# Altium project Macropad V2.PrjPcb
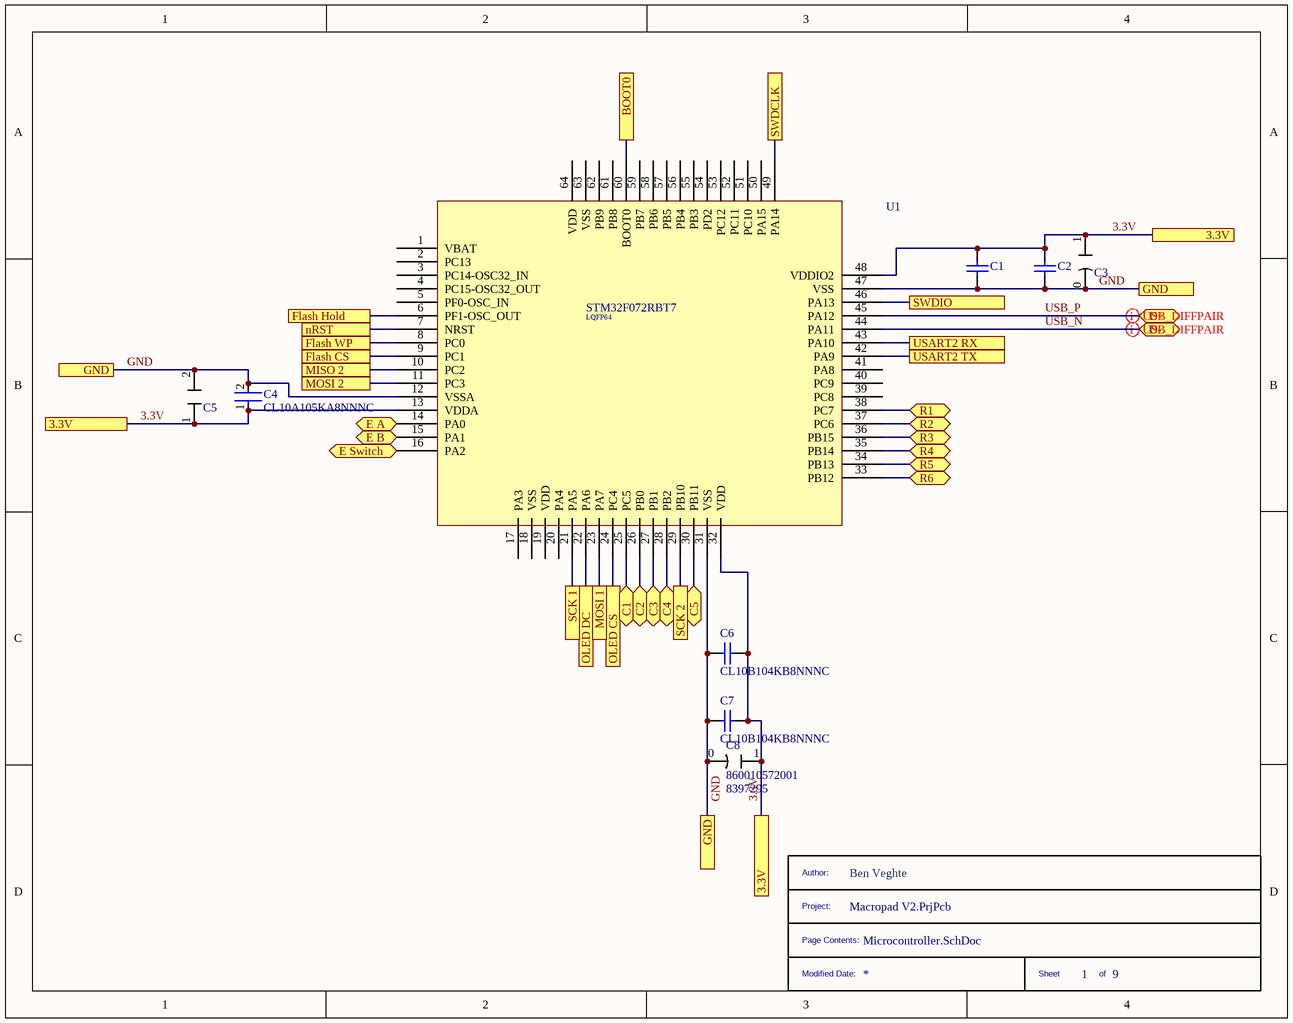
[diagram p0: Microcontroller.SchDoc]
9 sheets, 127 parts. Net scope: flat (ports and power ports of the same name join across sheets).
Board file: Macropad V2.PcbDoc
Sheets:
  Microcontroller.SchDoc
  Battery Load Share V2.SchDoc
  Reset Bootloader and Mounting.SchDoc
  Keyboard Matrix.SchDoc
  USB C Port.SchDoc
  Bluetooth.SchDoc
  Rotary Encoder.SchDoc
  OLED.SchDoc
  Flash Memory.SchDoc

## Sheet Microcontroller.SchDoc
size A; SheetNumber: 1; SheetTotal: 9

### Parts
(Parts that share a designator on the sheet are numbered #1, #2 ... from top to bottom, then left to right.)
*#1  __TITLE_BLOCK__  (value not drawn)  (graphical)
C1  CL10B104KB8NNNC  [SAMS-C0603-2_M]  (value not drawn)
C2  CL10B104KB8NNNC  [SAMS-C0603-2_M]  (value not drawn)
C3  860010572001  [860010572001]  (value not drawn)
C4  CL10A105KA8NNNC  [FP-CL10-IPC_C]
C5  CL10B103KB8NNNC  [CL10B103KB8NNNC]  (value not drawn)
C6  CL10B104KB8NNNC  [SAMS-C0603-2_M]
C7  CL10B104KB8NNNC  [SAMS-C0603-2_M]
C8  860010572001  Supplier Part Number 1: 8397295  [860010572001]
U1  STM32F072RBT7  [STM32F072RBT6]  (value not drawn)

### Ports
3.3V, BOOT0, C1 (bidir), C2 (bidir), C3 (bidir), C4 (bidir), C5 (bidir), D+ (bidir), D- (bidir), E A (bidir), E B (bidir), E Switch (bidir), Flash CS, Flash Hold, Flash WP, GND, MISO 2, MOSI 1, MOSI 2, nRST, OLED CS, OLED DC, R1 (bidir), R2 (bidir), R3 (bidir), R4 (bidir), R5 (bidir), R6 (bidir), SCK 1, SCK 2, SWDCLK, SWDIO, USART2 RX, USART2 TX

### Nets
3.3V: C1.2 C2.2 C3.1 C4.1 C5.1 C6.2 C7.2 C8.1 U1.13(VDDA) U1.32(VDD) U1.48(VDDIO2) ; port 3.3V
GND: C1.1 C2.1 C3.0 C4.2 C5.2 C6.1 C7.1 C8.0 U1.12(VSSA) U1.31(VSS) U1.47(VSS) ; port GND
USB_N: U1.44(PA11) ; port D-
USB_P: U1.45(PA12) ; port D+
NetC9_1: U1.16(PA2) ; port E Switch
NetC10_1: U1.14(PA0) ; port E A
NetC11_2: U1.15(PA1) ; port E B
NetC19_1: U1.7(NRST) ; port nRST
NetD1_1: U1.25(PC5) ; port C1
NetD2_1: U1.26(PB0) ; port C2
NetD3_1: U1.27(PB1) ; port C3
NetD4_1: U1.28(PB2) ; port C4
NetD5_1: U1.30(PB11) ; port C5
NetJ2_8: U1.24(PC4) ; port OLED CS
NetJ2_10: U1.22(PA6) ; port OLED DC
NetJ2_11: U1.21(PA5) ; port SCK 1
NetJ2_12: U1.23(PA7) ; port MOSI 1
NetJ3_2: U1.46(PA13) ; port SWDIO
NetJ3_4: U1.49(PA14) ; port SWDCLK
NetR9_1: U1.60(BOOT0) ; port BOOT0
NetS1_0: U1.38(PC7) ; port R1
NetS6_0: U1.37(PC6) ; port R2
NetS11_0: U1.36(PB15) ; port R3
NetS16_0: U1.35(PB14) ; port R4
NetS21_0: U1.34(PB13) ; port R5
NetS26_0: U1.33(PB12) ; port R6
NetU1_6: U1.6(PF1-OSC_OUT) ; port Flash Hold
NetU1_8: U1.8(PC0) ; port Flash WP
NetU1_9: U1.9(PC1) ; port Flash CS
NetU1_10: U1.10(PC2) ; port MISO 2
NetU1_11: U1.11(PC3) ; port MOSI 2
NetU1_29: U1.29(PB10) ; port SCK 2
NetU1_42: U1.42(PA9) ; port USART2 TX
NetU1_43: U1.43(PA10) ; port USART2 RX

Not connected (* = marked no-connect by the designer): U1 1(VBAT) 2(PC13) 3(PC14-OSC32_IN) 4(PC15-OSC32_OUT) 5(PF0-OSC_IN) 17(PA3) 18(VSS) 19(VDD) 20(PA4) 39(PC8) 40(PC9) 41(PA8) 50(PA15) 51(PC10) 52(PC11) 53(PC12) 54(PD2) 55(PB3) 56(PB4) 57(PB5) 58(PB6) 59(PB7) 61(PB8) 62(PB9) 63(VSS) 64(VDD)

### Layout directives
differential pair: USB_N, USB_P

### Notes on the sheet
- (in symbol __TITLE_BLOCK__) Author:; Ben Veghte; Project:; Page Contents:; Modified Date:; Sheet; of
- (in symbol STM32F072RBT7) LQFP64

### Library data of the parts
C1 C2 C6 C7 = CMP-2000-05332-1: Multi-layer Ceramic Capacitor, -55 to 125 degC, 2-Pin SMD (0603), RoHS, Tape and Reel; Manufacturer: Samsung Electro-Mechanics; Capacitance: 0.1µF; Rated Voltage: 50V; Dielectric: X7R; Tolerance (%): ±10%; Case Size/Dimension: 0603; Datasheet URL: https://datasheet.ciiva.com/29198/456651-da-01-en-vs-kondensator-0605-29198839.pdf; Manufacturer URL: http://www.samsungsem.com/global/index.jsp; Datasheet Version: Nov-10
C3 C8 = 860010572001: Aluminium Electrolytic Capacitor, Wcap-Atg8 Series, 4.7 F, 20%, 35 V, 5 Mm, Radial Leaded Rohs Compliant: Yes; Manufacturer: Wurth Electronics; Voltage Rating: 35V; Polarity: Polar; Ripple Current: 44mA; Life (Hours): 2000Hour; Capacitance: 4.7uF; Supplier 1: RSComponents; Manufacturer Part Number: 860010572001; RoHS: Yes; Category: Aluminum Electrolytic Capacitors; Stock 1: 1; Pricing 1: 50=0.09100, 250=0.06400, 500=0.05100, 1000=0.04900 (USD); Mount: Through Hole; Case/Package: Radial; Min Operating Temperature: -40°C; Max Operating Temperature: 85°C; Package Quantity: 2000; Packaging: Tape and Reel; Tolerance: 20%; Voltage Rating (DC): 35V; Diameter: 5mm; Height: 11mm; Lead Pitch: 0.079inch; Height - Seated (Max): 0.492inch; REACH SVHC: Unknown; RoHS Compliant: Yes; ComponentLink1URL: http://www.farnell.com/datasheets/1879541.pdf?src-supplier=Farnell; ComponentLink1Description: http://www.farnell.com/datasheets/1879541.pdf?src-supplier=Farnell; ComponentLink2URL: http://www.farnell.com/datasheets/1879541.pdf?src-supplier=Element14; ComponentLink2Description: http://www.farnell.com/datasheets/1879541.pdf?src-supplier=Element14; ComponentLink3URL: https://katalog.we-online.de/pbs/datasheet/860010572001.pdf?src-supplier=Digi-Key; ComponentLink3Description: https://katalog.we-online.de/pbs/datasheet/860010572001.pdf?src-supplier=Digi-Key; ComponentLink4URL: http://katalog.we-online.de/pbs/datasheet/860010572001.pdf?src-supplier=Digi-Key; ComponentLink4Description: http://katalog.we-online.de/pbs/datasheet/860010572001.pdf?src-supplier=Digi-Key
  C3: Supplier Part Number 1: 8397295
C4 = CMP-13271-004127-1: Cap Ceramic 1uF 25V X5R ±10% Pad SMD 0603 +85°C T/R; Height: 0.8mm; Capacitance: 1uF; Depth: 0.8mm; Package Quantity: 1; Mount: Surface Mount; Contact Plating: Tin; Voltage Rating: 25V; Dielectric: X5R; Packaging: Tape and Reel; Material: Ceramic; Case Code (Metric): 1608; Length: 1.6mm; Voltage: 25V; Min Operating Temperature: -55°C; Width: 0.031inch; Tolerance: 10%; Case/Package: 0603; Radiation Hardening: No; Case Code (Imperial): 0603; Thickness: 0.035inch; Lead Free: Lead Free; Max Operating Temperature: 85°C; Voltage Rating (DC): 25V
C5 = CL10B103KB8NNNC: CAP CER 10000PF 50V X7R 0603; Manufacturer: Samsung; Material: Ceramic; Capacitance: 10nF; Tolerance: 10%; Supplier 1: Arrow Electronics; Manufacturer Part Number: CL10B103KB8NNNC; RoHS: Yes; Category: Ceramic Capacitors; Stock 1: 4784000; Pricing 1: 4000=0.00480, 8000=0.00470, 12000=0.00440, 40000=0.00350 (USD); Mount: Surface Mount; Case/Package: 0603; Case Code (Metric): 1608; Case Code (Imperial): 0603; Contact Plating: Tin; Min Operating Temperature: -55°C; Max Operating Temperature: 125°C; Dielectric: X7R; Voltage Rating: 50V; Package Quantity: 1; Packaging: Tape and Reel; Voltage: 50V; Voltage Rating (DC): 50V; Series: CL; Construction: Flat; Length: 1.6mm; Width: 0.031inch; Height: 0.8mm; Depth: 0.8mm; Thickness: 0.035inch; Radiation Hardening: No; Lead Free: Lead Free; RoHS Compliant: Yes; ComponentLink1URL: https://datasheet.ciiva.com/15195/getdatasheetpartid-357415-15195721.pdf?src-supplier=Verical; ComponentLink1Description: https://datasheet.ciiva.com/15195/getdatasheetpartid-357415-15195721.pdf?src-supplier=Verical; ComponentLink2URL: https://datasheet.ciiva.com/29198/457455-da-01-en-vs-kondensator-0603-29198644.pdf?src-supplier=Conrad; ComponentLink2Description: https://datasheet.ciiva.com/29198/457455-da-01-en-vs-kondensator-0603-29198644.pdf?src-supplier=Conrad; Supplier Part Number 1: CL10B103KB8NNNC
U1 = STM32F072RBT7: MCU 32-Bit ARM Cortex-M0 RISC 64KB Flash 2V to 3.6V 64-Pin LQFP Tray; Manufacturer: STMicroelectronics; Interface: I2C,SPI,USB,HDMI,IrDA,UART,USART; Peripherals: POR,PWM,WDT,DMA; Frequency: 48MHz; Number of I/Os: 51; Memory Size: 128KB; Oscillator Type: Internal; Supplier 1: Newark; Manufacturer Part Number: STM32F072RBT7; RoHS: Yes; Category: Microcontrollers; Stock 1: 885; Pricing 1: 1=7.63000, 10=6.86000, 25=6.49000, 50=6.05000, 100=5.62000, 250=5.10000, 500=4.79000 (USD); Case/Package: LQFP; Min Operating Temperature: -40°C; Max Operating Temperature: 105°C; Memory Type: FLASH; Packaging: Tray; Core Architecture: ARM; ComponentLink1URL: http://www.st.com/content/ccc/resource/technical/document/datasheet/cd/46/43/83/22/d3/40/c8/DM00090510.pdf/files/DM00090510.pdf/jcr:content/translations/en.DM00090510.pdf?src-supplier=Digi-Key; ComponentLink1Description: http://www.st.com/content/ccc/resource/technical/document/datasheet/cd/46/43/83/22/d3/40/c8/DM00090510.pdf/files/DM00090510.pdf/jcr:content/translations/en.DM00090510.pdf?src-supplier=Digi-Key

## Sheet Battery Load Share V2.SchDoc
size A; SheetNumber: 2; SheetTotal: 9
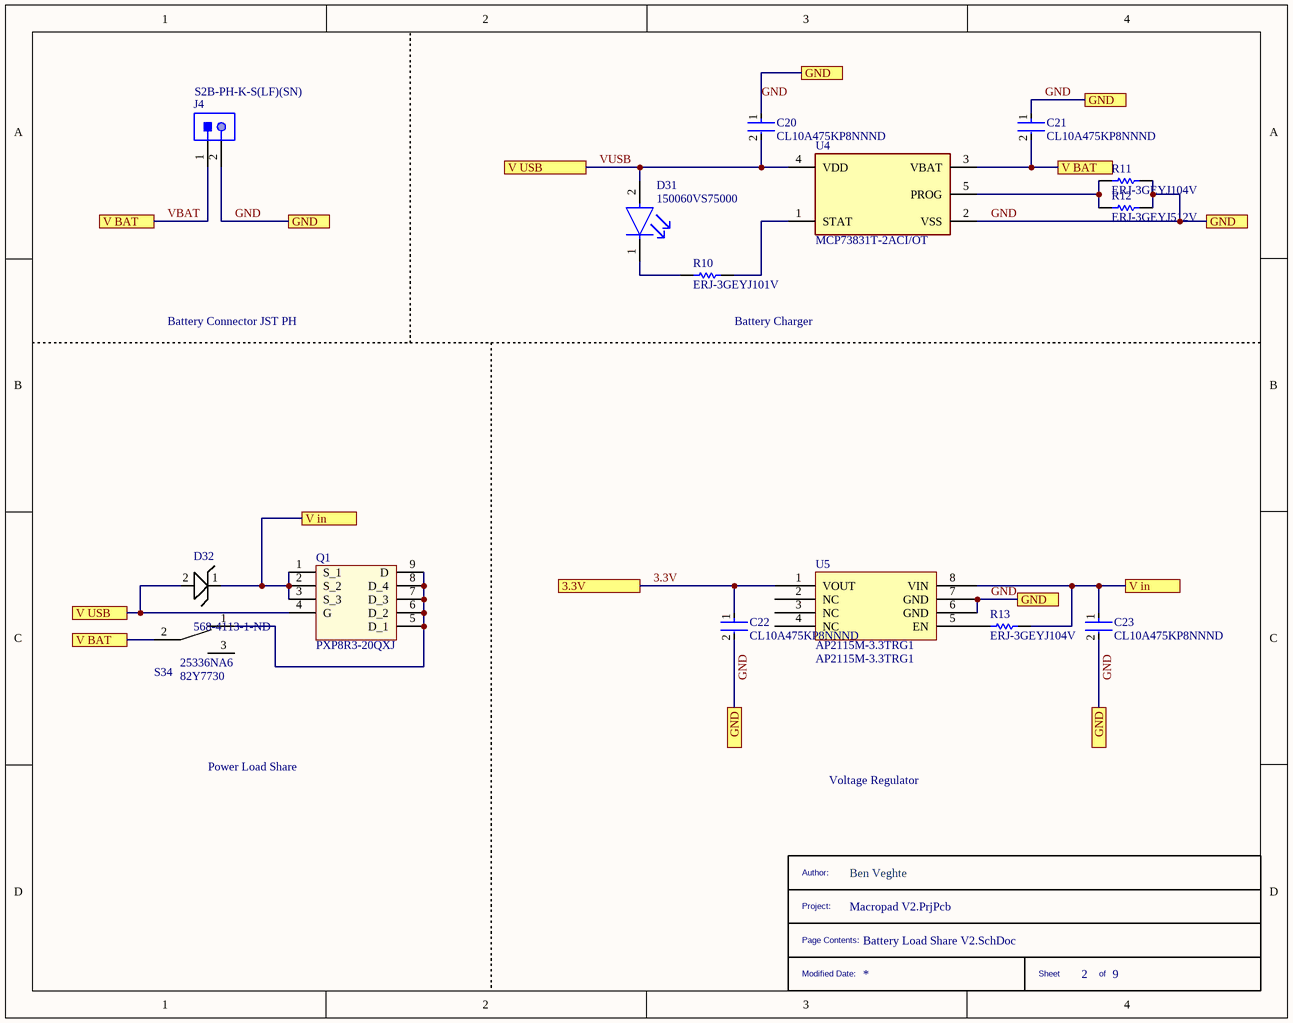
[diagram p1: Battery Load Share V2.SchDoc]

### Parts
(Parts that share a designator on the sheet are numbered #1, #2 ... from top to bottom, then left to right.)
*#2  __TITLE_BLOCK__  (value not drawn)  (graphical)
C20  CL10A475KP8NNND  [FP-CL10-IPC_C]
C21  CL10A475KP8NNND  [FP-CL10-IPC_C]
C22  CL10A475KP8NNND  [FP-CL10-IPC_C]
C23  CL10A475KP8NNND  [FP-CL10-IPC_C]
D31  150060VS75000  [FP-150060VS75000-MFG]
D32  Supplier Part Number 1: 568-4113-1-ND  [PMEG2010AEJ]  (hidden comment: PMEG2010AEJ115)
J4  S2B-PH-K-S(LF)(SN)  [JST-S2B-PH-K-S_V]
Q1  PXP8R3-20QXJ  [PXP8R3-20QXJ]
R10  ERJ-3GEYJ101V  [RESC1608X55X30LL15T15]
R11  ERJ-3GEYJ104V  [RESC1608X55X30NL15T15]
R12  ERJ-3GEYJ512V  [RESC1608X55X30LL15T15]
R13  ERJ-3GEYJ104V  [RESC1608X55X30NL15T15]
S34  25336NA6  Supplier Part Number 1: 82Y7730  [25336NA6]
U4  MCP73831T-2ACI/OT  [FP-C04-091-OT-IPC_B]
U5  AP2115M-3.3TRG1  [AP2115M-3.3TRG1]

### Ports
3.3V, GND, V BAT, V in, V USB

### Nets
3.3V: C22.1 U5.1(VOUT) ; port 3.3V
GND: C20.1 C21.1 C22.2 C23.2 J4.2 R11.2 R12.2 U4.2(VSS) U5.6(GND) U5.7(GND) ; port GND
VBAT: C21.2 J4.1 S34.2 U4.3(VBAT) ; port V BAT
VUSB: C20.2 D31.2(A) D32.2 Q1.4(G) U4.4(VDD) ; port V USB
NetC23_1: C23.1 D32.1 Q1.1(S_1) Q1.2(S_2) Q1.3(S_3) R13.2 U5.8(VIN) ; port V in
NetD31_1: D31.1(C) R10.1
NetQ1_5: Q1.5(D_1) Q1.6(D_2) Q1.7(D_3) Q1.8(D_4) Q1.9(D) S34.1
NetR10_2: R10.2 U4.1(STAT)
NetR11_1: R11.1 R12.1 U4.5(PROG)
NetR13_1: R13.1 U5.5(EN)

Not connected (* = marked no-connect by the designer): S34 3; U5 2(NC) 3(NC) 4(NC)

### Notes on the sheet
- Battery Connector JST PH
- (near R10) Battery Charger
- Power Load Share
- Voltage Regulator
- (in symbol __TITLE_BLOCK__) Author:; Ben Veghte; Project:; Page Contents:; Modified Date:; Sheet; of

### Library data of the parts
C20-C23 = CMP-13271-003065-1: Cap Ceramic 4.7uF 10V X5R ±10% Pad SMD 0603 +85°C T/R; Height: 0.8mm; Tolerance: 10%; Capacitance: 4.7uF; Voltage Rating: 10V; Voltage Rating (DC): 10V; Packaging: Tape and Reel; Dielectric: X5R; Width: 0.031inch; Max Operating Temperature: 85°C; Radiation Hardening: No; Package Quantity: 10000; Case/Package: 0603; Mount: Surface Mount; Min Operating Temperature: -55°C; Thickness: 0.035inch; Length: 1.6mm; Depth: 0.8mm
D31 = CMP-1426-00006-5: LED GREEN CLEAR 0603 SMD; Viewing Angle: 140°; Reverse Voltage (DC): 5V; Forward Voltage: 2V; Power Rating: 72mW; Lens Size: 0.7mm; Test Current: 20mA; Lens Color: Colorless; Lens Style: Rectangular; Luminous Intensity: 40mcd; Wavelength: 570nm; Length: 1.6mm; Max Operating Temperature: 85°C; Lens Transparency: Clear; Width: 0.8mm; Mount: Surface Mount; Weight: 0.000882oz; Package Quantity: 4000; Packaging: Cut Tape; RoHS Compliant: Yes; Case/Package: 0603; Series: WL-SMCW; Case Code (Metric): 1608; Illumination Color: Green; Color: Green; Case Code (Imperial): 0603; Forward Current: 20mA; Min Operating Temperature: -40°C; Height: 0.8mm; Dominant Wavelength: 570nm; Number of Pins: 2
D32 = PMEG2010AEJ115: NXP         PMEG2010AEJ,115             Schottky Rectifier, Single, 20 V, 1 A, SOD-323F, 2 Pins, 550 mV; Manufacturer: NXP Semiconductors; Max Surge Current: 10A; Forward Current: 1A; Max Reverse Current: 70uA; Forward Voltage: 550mV; Max Repetitive Reverse Voltage (Vrrm): 20V; Supplier 1: Digi-Key; Manufacturer Part Number: PMEG2010AEJ115; RoHS: Yes; Category: Schottky Diodes; Mount: Surface Mount; Number of Pins: 2; Weight: 0.01lb; Min Operating Temperature: -65°C; Max Operating Temperature: 150°C; Package Quantity: 1; Packaging: Tape and Reel; Max Reverse Leakage Current: 70uA; Average Rectified Current: 1A; Peak Non-Repetitive Surge Current: 10A; Max Forward Surge Current (Ifsm): 10A; Termination: SMD/SMT; Element Configuration: Single; Max Reverse Voltage (DC): 20V; Length: 0.25inch; Width: 0.25inch; Height: 0.25inch; Radiation Hardening: No; REACH SVHC: No SVHC; Lead Free: Lead Free; ComponentLink1URL: https://datasheet.ciiva.com/28648/666247-28648370.pdf?src-supplier=Element14; ComponentLink1Description: https://datasheet.ciiva.com/28648/666247-28648370.pdf?src-supplier=Element14; ComponentLink2URL: https://datasheet.ciiva.com/913/pmeg2010aej-913523.pdf?src-supplier=Digi-Key; ComponentLink2Description: https://datasheet.ciiva.com/913/pmeg2010aej-913523.pdf?src-supplier=Digi-Key; ComponentLink3URL: https://datasheet.ciiva.com/4714/pmeg2010aej-117858-4714480.pdf?src-supplier=Mouser; ComponentLink3Description: https://datasheet.ciiva.com/4714/pmeg2010aej-117858-4714480.pdf?src-supplier=Mouser; ComponentLink4URL: https://datasheet.ciiva.com/7965/666247-7965049.pdf?src-supplier=Element14; ComponentLink4Description: https://datasheet.ciiva.com/7965/666247-7965049.pdf?src-supplier=Element14; ComponentLink5URL: https://datasheet.ciiva.com/31423/666247-31423031.pdf?src-supplier=Farnell; ComponentLink5Description: https://datasheet.ciiva.com/31423/666247-31423031.pdf?src-supplier=Farnell; ComponentLink6URL: https://datasheet.ciiva.com/913/pmeg2010aej-913524.pdf?src-supplier=Digi-Key; ComponentLink6Description: https://datasheet.ciiva.com/913/pmeg2010aej-913524.pdf?src-supplier=Digi-Key; ComponentLink7URL: https://datasheet.ciiva.com/913/pmeg2010aej-913525.pdf?src-supplier=Digi-Key; ComponentLink7Description: https://datasheet.ciiva.com/913/pmeg2010aej-913525.pdf?src-supplier=Digi-Key
J4 = CMP-1755-00004-1: Male Header, Pitch 2 mm, 1 x 2 Position, Height 4.8 mm, Tail Length 3.4 mm, -25 to 85 degC, RoHS, Bulk; Case\Package: Radial; Tolerance: 20%; Capacitance: 10 uF; Voltage Rating (DC): 50 V; Packaging: Bulk; ComponentLink1URL: http://www.jst-mfg.com/product/pdf/eng/ePH.pdf; Radiation Hardening: No; Height: 11 mm; Package Quantity: 200; PackageDescription: Male Header, Pitch 2 mm, 1 x 2 Position, Height 4.8 mm, Tail Length 3.4 mm; PackageReference: S2B-PH-K-S; Diameter: 5 mm; Pins: 2; Mount: Through Hole; Max Operating Temperature: 85 degC; Min Operating Temperature: -40 degC; ComponentLink1Description: Datasheet; DatasheetVersion: Dec-12; Length: 11 mm; Lead Pitch: 2 mm; REACH SVHC: No SVHC; Voltage Rating: 50 V; RoHSCompliant: true
Q1 = PXP8R3-20QXJ: PXP8R3-20QX - 20 V, P-channel Trench MOSFET; Manufacturer: Nexperia; Supplier 1: Arrow Electronics; Manufacturer Part Number: PXP8R3-20QXJ; RoHS: No; Category: Uncategorized; Stock 1: 1756; Pricing 1: 1=0.70830, 10=0.62250, 25=0.61630, 50=0.61020, 100=0.46530, 250=0.46060, 500=0.34520, 1000=0.29630 (USD); Supplier Part Number 1: PXP8R3-20QXJ
R10 = CMP-2000-00702-1: Manufacturer: Panasonic; Part Number: ERJ-3GEYJ101V
R11 R13 = CMP-2000-00705-1: Manufacturer: Panasonic; Part Number: ERJ-3GEYJ104V
R12 = CMP-2000-00803-1: Manufacturer: Panasonic; Part Number: ERJ-3GEYJ512V
S34 = 25336NA6: Switch Slide ON ON SPDT Side Slide 1A 30VDC 20000Cycles PC Pins Thru-Hole; Manufacturer: APEM; Actuator Material: Nylon,Glass,Polyamide; Contact Current Rating: 4A; Voltage Rating (AC): 125V; Max Voltage Rating (AC): 250V; Voltage Rating (DC): 30V; Illumination Type: Non-Illuminated; Electrical Life: 10000Cycles; Switch Travel: 4mm; Switch Function: On-On; Actuator Type: Standard; Actuator Length: 6mm; Supplier 1: Newark; Manufacturer Part Number: 25336NA6; RoHS: Yes; Category: Slide Switches; Stock 1: 209; Pricing 1: 1=4.37000, 10=3.91000, 25=3.70000, 50=3.57000, 100=3.38000, 250=3.13000 (USD); Mount: Through Hole; Contact Plating: Silver; Contact Material: Silver; Mechanical Life: 20000Cycles; Min Operating Temperature: -40°C; Max Operating Temperature: 85°C; Package Quantity: 100; Throw Configuration: SPDT; Max Current Rating: 1A; Packaging: Bulk; Current Rating: 1A; Max Voltage Rating (DC): 30V; Termination: PC Pins; Orientation: Right Angle; Length: 14.1mm; Depth: 13.5mm; REACH SVHC: No SVHC; RoHS Compliant: Yes; ComponentLink1URL: https://datasheet.ciiva.com/22638/1686052-22638216.pdf?src-supplier=Element14; ComponentLink1Description: https://datasheet.ciiva.com/22638/1686052-22638216.pdf?src-supplier=Element14
U4 = CMP-0133-00143-2: IC CONTROLLR LI-ION 4.2V SOT23-5; Max Power Dissipation: 1.54W; Output Current: 500mA; Max Output Voltage: 4.5V; Number of Outputs: 1; Min Output Voltage: 4.168V; Min Supply Voltage: 3.75V; Max Input Voltage: 6V; Voltage Rating: 4.534V; Drain to Source Resistance: 350mR; Max Operating Temperature: 85°C; Length: 0.122inch; Number of Pins: 5; REACH SVHC: No SVHC; Radiation Hardening: No; Min Operating Temperature: -40°C; Weight: 0.00709oz; Contact Plating: Tin; Termination: SMD/SMT; Case/Package: SOT-23; Mount: Surface Mount; Width: 0.071inch; Packaging: Tape and Reel; Number of Cells: 1; Max Charge Current: 500mA; Height: 0.051inch; Number of Channels: 1; Output Voltage: 4.2V; Max Supply Voltage: 6V; Lead Free: Lead Free
U5 = AP2115M-3.3TRG1: LDO Regulator Pos 3.3V 1A 8-Pin SOIC T/R; Manufacturer: Diodes; Dropout Voltage: 450mV; Number of Regulators: 1; Supplier 1: Arrow Electronics; Manufacturer Part Number: AP2115M-3.3TRG1; RoHS: Yes; Category: Voltage Regulators - Linear; Stock 1: 3960; Pricing 1: 1=0.39860, 10=0.32620, 25=0.30340, 100=0.20830, 250=0.19280, 500=0.15840, 1000=0.11820, 3000=0.11710 (USD); Mount: Surface Mount; Case/Package: SOIC; Min Operating Temperature: -40°C; Max Operating Temperature: 85°C; Packaging: Tape and Reel; Output Voltage: 3.3V; Output Current: 1A; RoHS Compliant: Yes; ComponentLink1URL: http://www.mouser.com/ds/2/115/AP2115-464923.pdf?src-supplier=Mouser; ComponentLink1Description: http://www.mouser.com/ds/2/115/AP2115-464923.pdf?src-supplier=Mouser; ComponentLink2URL: https://www.diodes.com/assets/Datasheets/AP2115.pdf?src-supplier=Digi-Key; ComponentLink2Description: https://www.diodes.com/assets/Datasheets/AP2115.pdf?src-supplier=Digi-Key; Supplier Part Number 1: AP2115M-3.3TRG1

## Sheet Reset Bootloader and Mounting.SchDoc
size A; SheetNumber: 3; SheetTotal: 9
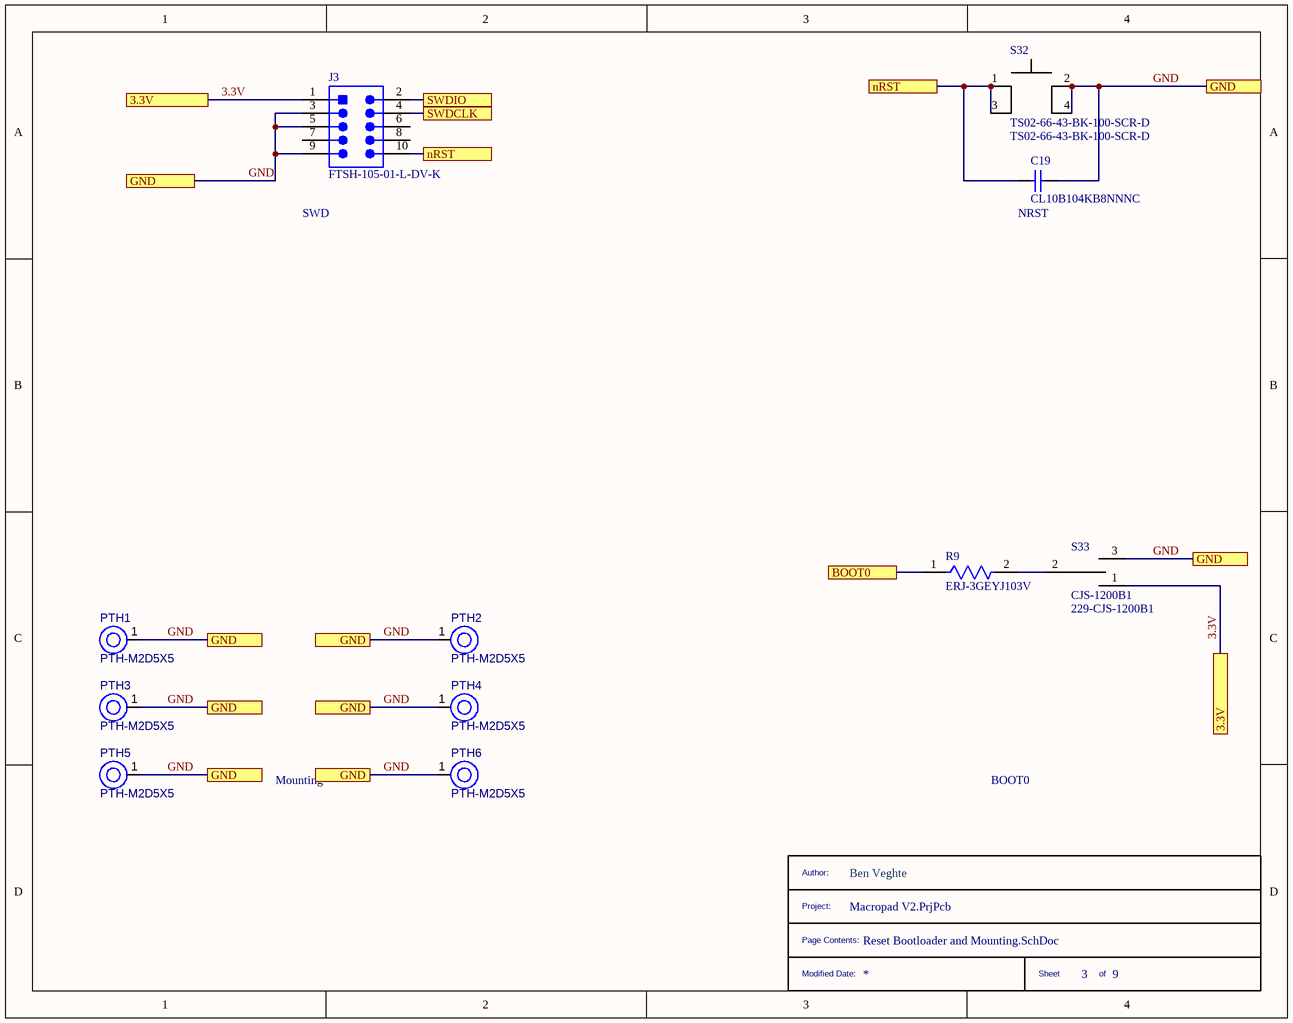
[diagram p2: Reset Bootloader and Mounting.SchDoc]

### Parts
(Parts that share a designator on the sheet are numbered #1, #2 ... from top to bottom, then left to right.)
*#3  __TITLE_BLOCK__  (value not drawn)  (graphical)
C19  CL10B104KB8NNNC  [SAMS-C0603-2_M]
J3  FTSH-105-01-L-DV-K  [SMTC-FTSH-105-01-L-DV-K_V]
PTH1  PTH-M2D5X5  [PTH-M2D5X5]
PTH2  PTH-M2D5X5  [PTH-M2D5X5]
PTH3  PTH-M2D5X5  [PTH-M2D5X5]
PTH4  PTH-M2D5X5  [PTH-M2D5X5]
PTH5  PTH-M2D5X5  [PTH-M2D5X5]
PTH6  PTH-M2D5X5  [PTH-M2D5X5]
R9  ERJ-3GEYJ103V  [FP-ERJ3G-IPC_C]
S32  TS02-66-43-BK-100-SCR-D  [TS02-66-43-BK-100-SCR-D]
S33  CJS-1200B1  Supplier Part Number 2: 229-CJS-1200B1  [CJS-1200B1]

### Ports
3.3V, BOOT0, GND, nRST, SWDCLK, SWDIO

### Nets
3.3V: J3.1 S33.1 ; port 3.3V
GND: C19.2 J3.3 J3.5 J3.9 PTH1.1(H1) PTH2.1(H1) PTH3.1(H1) PTH4.1(H1) PTH5.1(H1) PTH6.1(H1) S32.2 S32.4 S33.3 ; port GND
NetC19_1: C19.1 J3.10 S32.1 S32.3 ; port nRST
NetJ3_2: J3.2 ; port SWDIO
NetJ3_4: J3.4 ; port SWDCLK
NetR9_1: R9.1 ; port BOOT0
NetR9_2: R9.2 S33.2

Not connected (* = marked no-connect by the designer): J3 6 7 8

### Notes on the sheet
- SWD
- (near C19) NRST
- Mounting
- BOOT0
- (in symbol __TITLE_BLOCK__) Author:; Ben Veghte; Project:; Page Contents:; Modified Date:; Sheet; of

### Library data of the parts
C19 = CMP-2000-05332-1: as C1 on sheet Microcontroller; Case Size/Dimension: 0603; Datasheet URL: https://datasheet.ciiva.com/29198/456651-da-01-en-vs-kondensator-0605-29198839.pdf; Manufacturer URL: http://www.samsungsem.com/global/index.jsp; Datasheet Version: Nov-10
J3 = CMP-2000-05353-1: Male Header, Pitch 1.27 mm, 2 x 5 Position, Height 6.25 mm; Manufacturer: Samtec; Pitch: 0.050"(1.27mm); Other Names: Q3937619; Number of Positions: 10; Mating Products: SFMC-105-L2-S-D-TR-ND / -CONN.05"SURFACE10POSSMT / FLE-105-01-G-DV-TR-ND / -CONNSKT1.27MM10POSDUALSMD / FLE-105-01-G-DV-A-P-ND / -CONNSKT1.27MM10POSDUALSMD / FLE-105-01-G-DV-A-ND / -CONNSKT1.27MM10POSDUALSMD / CLP-105-02-G-D-P-TR-ND / -CONNRCPT10POSDUAL.05"SMD / SAM1155-05-ND / -CONNRCPT10POSDUAL.05"SMD / SAM1154-05-ND / -CONNRCPT10POSDUAL.05"SMD / SAM1153-05-ND / -CONNRCPT10POSDUAL.05"SMD / SAM1226-05-ND / -CONNRCPT.05"10POSDUALSMD; Number of Positions Loaded: All; Connector Type: Header,Unshrouded; Product Training Modules: Board-to-BoardConnectors; Datasheet Version: Rev. ET, 10/1995; Number of Rows: 2; Standard Package: 1; Package Description: Male Header, Pitch 1.27 mm, 2 x 5 Position, Height 5.97 mm, Tail Length 4.32 mm; Contact Finish Thickness: 10µin(0.25µm); Series: FTSH; Termination: Solder; Contact Type: MalePin; Color: Black; Package Reference: FTSH-105-01-L-DV-K; Family: RectangularConnectors-Headers,MalePins; Package URL: http://suddendocs.samtec.com/prints/ftsh-1xx-xx-xxx-dv-xxx-footprint.pdf; Packaging: Tube; Mounting Type: SurfaceMount; Category: Connectors,Interconnects; Datasheet URL: http://suddendocs.samtec.com/prints/ftsh-1xx-xx-xxx-dv-xxx-mkt.pdf; Row Spacing: 0.050"(1.27mm); Manufacturer URL: http://www.samtec.com/; Contact Mating Length: 0.120"(3.05mm); Contact Finish: Gold
PTH1-PTH6 = CMP-00028-00004-2: M2 PTH (2.5mm), 5mm pad; Pins: 1
R9 = CMP-2000-00704-2: RES SMD 10K OHM 5% 1/10W 0603; Temperature Coefficient: 200ppm/°C; Max Power Dissipation: 100mW; Resistance: 10kR; Voltage Rating (DC): 50V; Voltage Rating: 75V; Resistor Type: Thick Film; Tolerance: 5%; Military Standard: Not; Package Quantity: 1; Max Operating Temperature: 155°C; Mount: Surface Mount; Technology: THICK FILM; Case/Package: 0603; Construction: Rectangular; Depth: 0.8mm; Case Code (Imperial): 0603; Weight: 7.1E-05oz; Features: Automotive AEC-Q200; Packaging: Tape and Reel; Width: 0.8mm; Length: 1.6mm; Termination: SMD/SMT; Power Rating: 100mW; Lead Free: Lead Free; Number of Terminations: 2; Height: 0.45mm; RoHS Compliant: Yes; Min Operating Temperature: -55°C; Contact Plating: Tin; REACH SVHC: No SVHC; Resistance Tolerance: 5%; Series: ERJ; Working Voltage: 75V; Case Code (Metric): 1608
S32 = TS02-66-43-BK-100-SCR-D: Switch Tactile OFF (ON) SPST Round Button PC Pins 0.05A 12VDC 100000Cycles 1N Thru-Hole Bag; Manufacturer: CUI Devices; Supplier 1: Arrow Electronics; Manufacturer Part Number: TS02-66-43-BK-100-SCR-D; RoHS: No; Stock 1: 6000; Pricing 1: 1=0.09100, 25=0.08560, 100=0.07670, 250=0.07150, 500=0.06460, 1000=0.05270, 2000=0.05130, 5000=0.04740 (USD); Supplier Part Number 1: TS02-66-43-BK-100-SCR-D
S33 = CJS-1200B1: Switch Slide N.O./N.C. SPDT Raised Slide 0.1A 24VDC Gull Wing SMD Bulk; Manufacturer: CUI; Manufacturer Part Number: DS01-254-L-01BE; Max Voltage Rating (DC): 24V; Supplier 1: Mouser; RoHS: Yes; Supplier 2: Mouser; Category: DIP Switches; Stock 2: 600; Pricing 2: 1=0.73000, 10=0.64700, 20=0.63300, 50=0.63300, 100=0.63200, 200=0.56100, 500=0.53500, 1000=0.51700, 2000=0.49800, 10000=0.49800 (USD); Mount: Surface Mount; Case/Package: SMD/SMT; Contact Plating: Gold; Contact Material: Copper Alloy; Min Operating Temperature: -40°C; Max Operating Temperature: 85°C; Throw Configuration: SPDT; Packaging: Bulk; Termination: Gull Wing; Radiation Hardening: No; Lead Free: Lead Free; RoHS Compliant: Yes; ComponentLink1URL: https://www.nidec-copal-electronics.com/e/catalog/switch/cjs.pdf?src-supplier=Digi-Key; ComponentLink1Description: https://www.nidec-copal-electronics.com/e/catalog/switch/cjs.pdf?src-supplier=Digi-Key; ComponentLink2URL: http://www.nidec-copal-electronics.com/e/product/files/file/b1d651d581b7f6382a1a6c96f0c036e447720c59.pdf?src-supplier=Avnet; ComponentLink2Description: http://www.nidec-copal-electronics.com/e/product/files/file/b1d651d581b7f6382a1a6c96f0c036e447720c59.pdf?src-supplier=Avnet

## Sheet Keyboard Matrix.SchDoc
size B; SheetNumber: 4; SheetTotal: 9
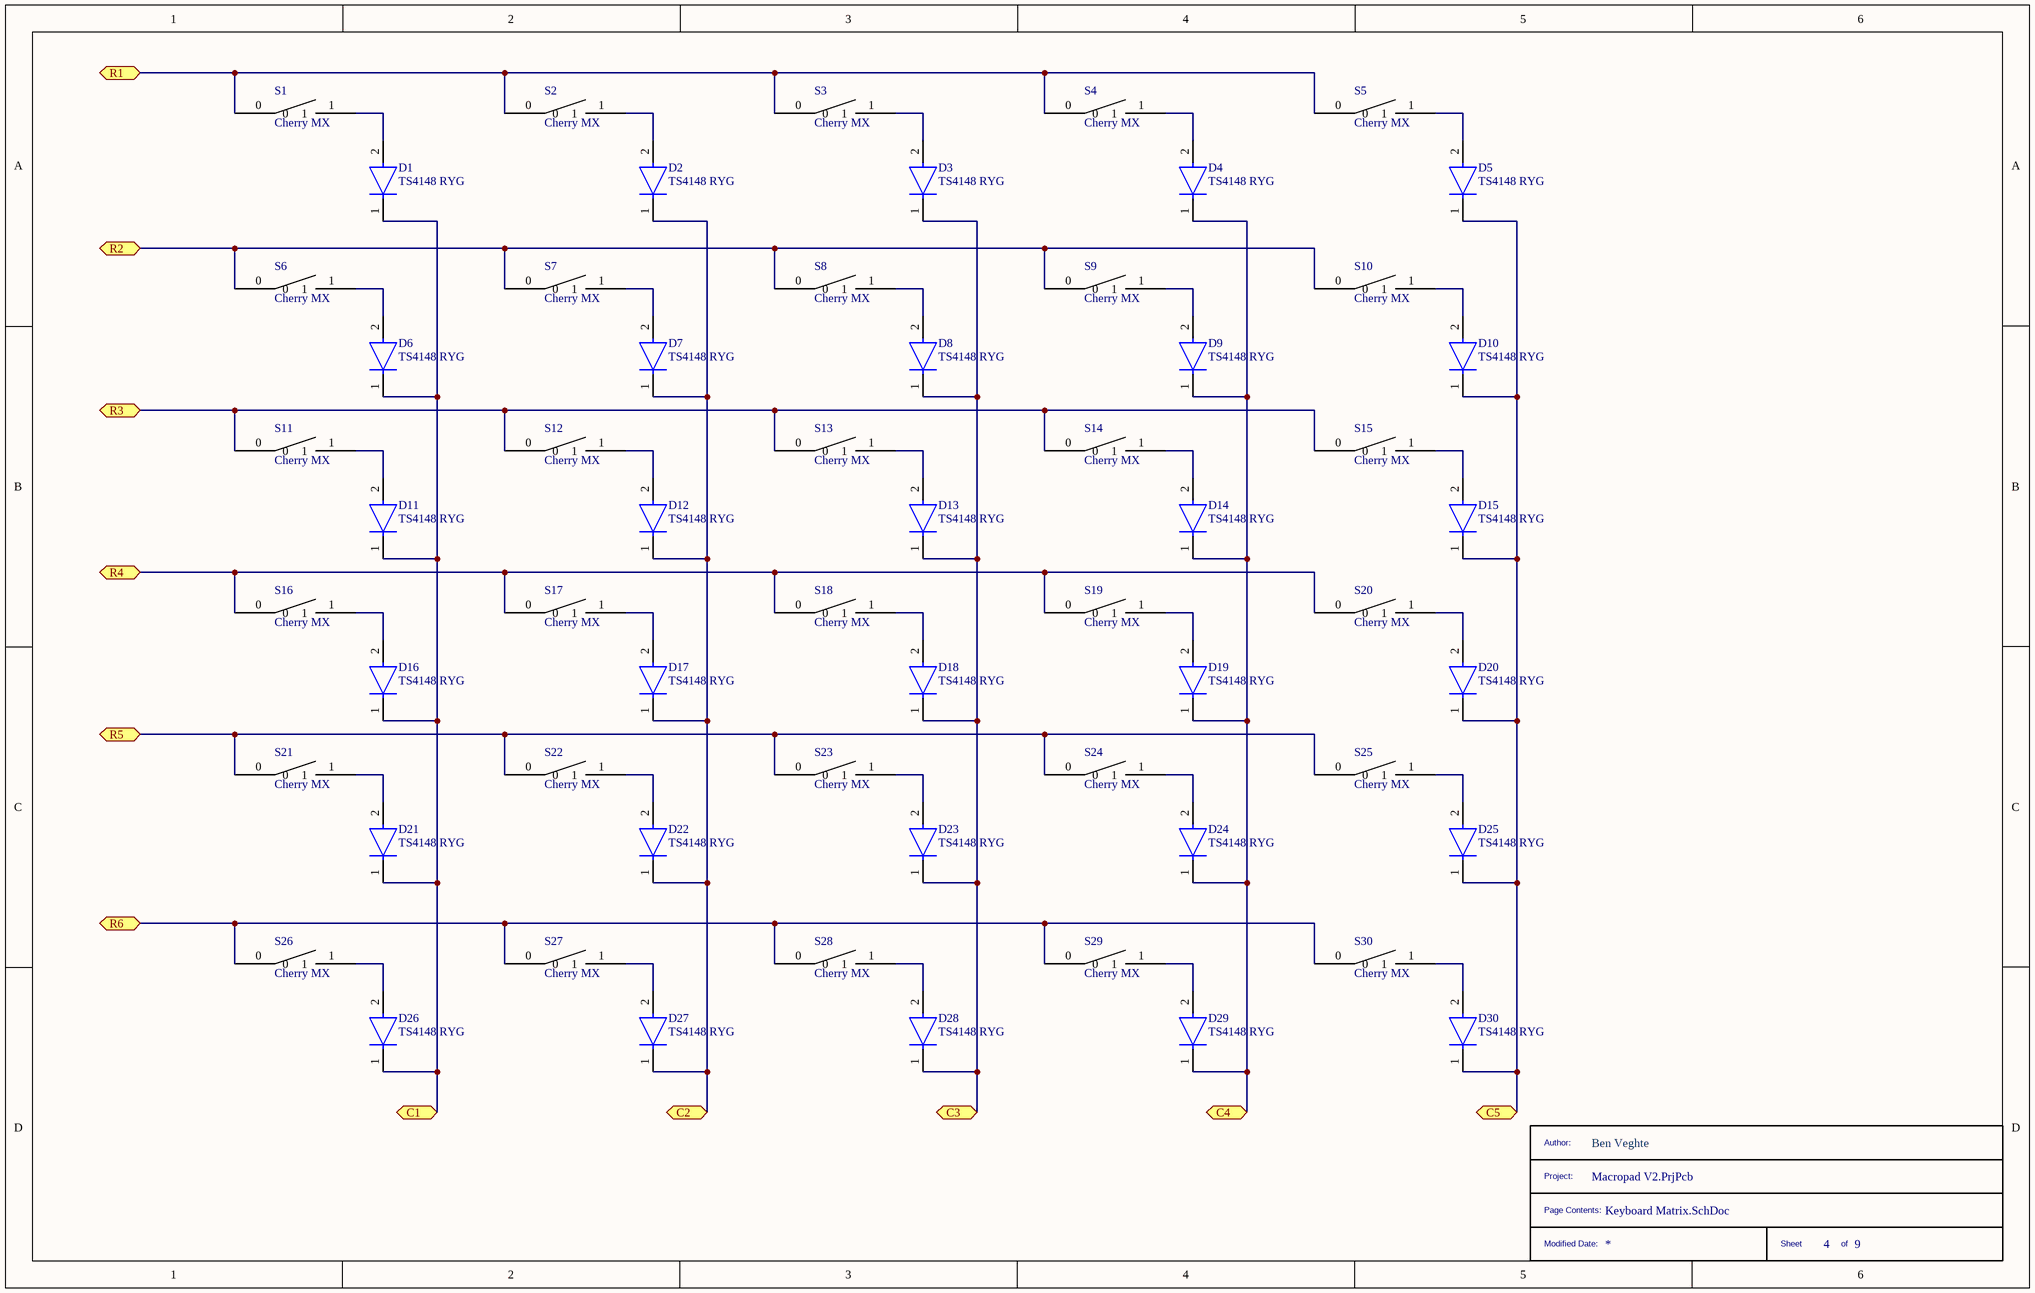
[diagram p3: Keyboard Matrix.SchDoc]

### Parts
(Parts that share a designator on the sheet are numbered #1, #2 ... from top to bottom, then left to right.)
*#4  __TITLE_BLOCK__  (value not drawn)  (graphical)
D1  TS4148 RYG  [FP-TS4148_RYG-MFG]
D2  TS4148 RYG  [FP-TS4148_RYG-MFG]
D3  TS4148 RYG  [FP-TS4148_RYG-MFG]
D4  TS4148 RYG  [FP-TS4148_RYG-MFG]
D5  TS4148 RYG  [FP-TS4148_RYG-MFG]
D6  TS4148 RYG  [FP-TS4148_RYG-MFG]
D7  TS4148 RYG  [FP-TS4148_RYG-MFG]
D8  TS4148 RYG  [FP-TS4148_RYG-MFG]
D9  TS4148 RYG  [FP-TS4148_RYG-MFG]
D10  TS4148 RYG  [FP-TS4148_RYG-MFG]
D11  TS4148 RYG  [FP-TS4148_RYG-MFG]
D12  TS4148 RYG  [FP-TS4148_RYG-MFG]
D13  TS4148 RYG  [FP-TS4148_RYG-MFG]
D14  TS4148 RYG  [FP-TS4148_RYG-MFG]
D15  TS4148 RYG  [FP-TS4148_RYG-MFG]
D16  TS4148 RYG  [FP-TS4148_RYG-MFG]
D17  TS4148 RYG  [FP-TS4148_RYG-MFG]
D18  TS4148 RYG  [FP-TS4148_RYG-MFG]
D19  TS4148 RYG  [FP-TS4148_RYG-MFG]
D20  TS4148 RYG  [FP-TS4148_RYG-MFG]
D21  TS4148 RYG  [FP-TS4148_RYG-MFG]
D22  TS4148 RYG  [FP-TS4148_RYG-MFG]
D23  TS4148 RYG  [FP-TS4148_RYG-MFG]
D24  TS4148 RYG  [FP-TS4148_RYG-MFG]
D25  TS4148 RYG  [FP-TS4148_RYG-MFG]
D26  TS4148 RYG  [FP-TS4148_RYG-MFG]
D27  TS4148 RYG  [FP-TS4148_RYG-MFG]
D28  TS4148 RYG  [FP-TS4148_RYG-MFG]
D29  TS4148 RYG  [FP-TS4148_RYG-MFG]
D30  TS4148 RYG  [FP-TS4148_RYG-MFG]
S1  Cherry MX  [Cherry MX]
S2  Cherry MX  [Cherry MX]
S3  Cherry MX  [Cherry MX]
S4  Cherry MX  [Cherry MX]
S5  Cherry MX  [Cherry MX]
S6  Cherry MX  [Cherry MX]
S7  Cherry MX  [Cherry MX]
S8  Cherry MX  [Cherry MX]
S9  Cherry MX  [Cherry MX]
S10  Cherry MX  [Cherry MX]
S11  Cherry MX  [Cherry MX]
S12  Cherry MX  [Cherry MX]
S13  Cherry MX  [Cherry MX]
S14  Cherry MX  [Cherry MX]
S15  Cherry MX  [Cherry MX]
S16  Cherry MX  [Cherry MX]
S17  Cherry MX  [Cherry MX]
S18  Cherry MX  [Cherry MX]
S19  Cherry MX  [Cherry MX]
S20  Cherry MX  [Cherry MX]
S21  Cherry MX  [Cherry MX]
S22  Cherry MX  [Cherry MX]
S23  Cherry MX  [Cherry MX]
S24  Cherry MX  [Cherry MX]
S25  Cherry MX  [Cherry MX]
S26  Cherry MX  [Cherry MX]
S27  Cherry MX  [Cherry MX]
S28  Cherry MX  [Cherry MX]
S29  Cherry MX  [Cherry MX]
S30  Cherry MX  [Cherry MX]

### Ports
C1 (bidir), C2 (bidir), C3 (bidir), C4 (bidir), C5 (bidir), R1 (bidir), R2 (bidir), R3 (bidir), R4 (bidir), R5 (bidir), R6 (bidir)

### Nets
NetD1_1: D1.1(C) D6.1(C) D11.1(C) D16.1(C) D21.1(C) D26.1(C) ; port C1
NetD1_2: D1.2(A) S1.1
NetD2_1: D2.1(C) D7.1(C) D12.1(C) D17.1(C) D22.1(C) D27.1(C) ; port C2
NetD2_2: D2.2(A) S2.1
NetD3_1: D3.1(C) D8.1(C) D13.1(C) D18.1(C) D23.1(C) D28.1(C) ; port C3
NetD3_2: D3.2(A) S3.1
NetD4_1: D4.1(C) D9.1(C) D14.1(C) D19.1(C) D24.1(C) D29.1(C) ; port C4
NetD4_2: D4.2(A) S4.1
NetD5_1: D5.1(C) D10.1(C) D15.1(C) D20.1(C) D25.1(C) D30.1(C) ; port C5
NetD5_2: D5.2(A) S5.1
NetD6_2: D6.2(A) S6.1
NetD7_2: D7.2(A) S7.1
NetD8_2: D8.2(A) S8.1
NetD9_2: D9.2(A) S9.1
NetD10_2: D10.2(A) S10.1
NetD11_2: D11.2(A) S11.1
NetD12_2: D12.2(A) S12.1
NetD13_2: D13.2(A) S13.1
NetD14_2: D14.2(A) S14.1
NetD15_2: D15.2(A) S15.1
NetD16_2: D16.2(A) S16.1
NetD17_2: D17.2(A) S17.1
NetD18_2: D18.2(A) S18.1
NetD19_2: D19.2(A) S19.1
NetD20_2: D20.2(A) S20.1
NetD21_2: D21.2(A) S21.1
NetD22_2: D22.2(A) S22.1
NetD23_2: D23.2(A) S23.1
NetD24_2: D24.2(A) S24.1
NetD25_2: D25.2(A) S25.1
NetD26_2: D26.2(A) S26.1
NetD27_2: D27.2(A) S27.1
NetD28_2: D28.2(A) S28.1
NetD29_2: D29.2(A) S29.1
NetD30_2: D30.2(A) S30.1
NetS1_0: S1.0 S2.0 S3.0 S4.0 S5.0 ; port R1
NetS6_0: S6.0 S7.0 S8.0 S9.0 S10.0 ; port R2
NetS11_0: S11.0 S12.0 S13.0 S14.0 S15.0 ; port R3
NetS16_0: S16.0 S17.0 S18.0 S19.0 S20.0 ; port R4
NetS21_0: S21.0 S22.0 S23.0 S24.0 S25.0 ; port R5
NetS26_0: S26.0 S27.0 S28.0 S29.0 S30.0 ; port R6

### Notes on the sheet
- (in symbol __TITLE_BLOCK__) Author:; Ben Veghte; Project:; Page Contents:; Modified Date:; Sheet; of

### Library data of the parts
D1-D30 = CMP-15605-000006-1: Rectifier Diode Switching 75V 0.15A 4ns 2-Pin Case 0805(2012Metric) T/R; Peak Non-Repetitive Surge Current: 2A; Element Configuration: Single; Forward Voltage: 1V; Max Operating Temperature: 175°C; Packaging: Tape and Reel; Radiation Hardening: No; Min Operating Temperature: -65°C; Reverse Recovery Time: 4ns; Mount: Surface Mount; RoHS Compliant: Yes; Max Forward Surge Current (Ifsm): 2A; Case/Package: SMD/SMT; Number of Pins: 2; Max Repetitive Reverse Voltage (Vrrm): 75V
S1-S30 = Cherry MX: Cherry MX Brown With Fixation Pins

## Sheet USB C Port.SchDoc
size A; SheetNumber: 5; SheetTotal: 9
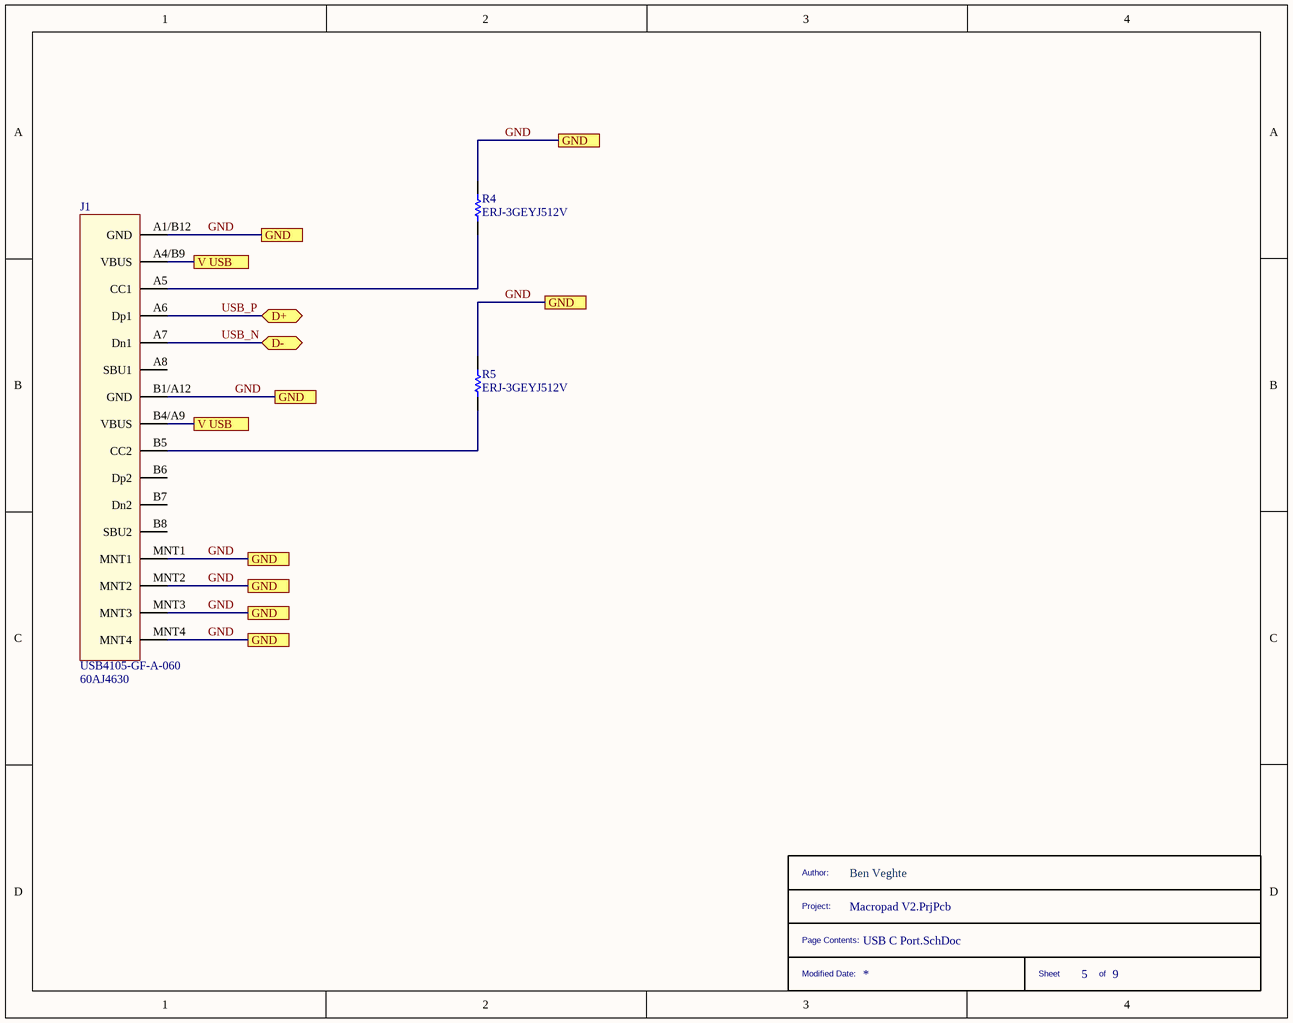
[diagram p4: USB C Port.SchDoc]

### Parts
(Parts that share a designator on the sheet are numbered #1, #2 ... from top to bottom, then left to right.)
*#5  __TITLE_BLOCK__  (value not drawn)  (graphical)
J1  USB4105-GF-A-060  Supplier Part Number 1: 60AJ4630  [USB4105-GF-A-120]
R4  ERJ-3GEYJ512V  [RESC1608X55X30LL15T15]
R5  ERJ-3GEYJ512V  [RESC1608X55X30LL15T15]

### Ports
D+ (bidir), D- (bidir), GND, V USB

### Nets
GND: J1.A1/B12(GND) J1.B1/A12(GND) J1.MNT1 J1.MNT2 J1.MNT3 J1.MNT4 R4.2 R5.2 ; port GND
USB_N: J1.A7(Dn1) ; port D-
USB_P: J1.A6(Dp1) ; port D+
VUSB: J1.A4/B9(VBUS) J1.B4/A9(VBUS) ; port V USB
NetJ1_A5: J1.A5(CC1) R4.1
NetJ1_B5: J1.B5(CC2) R5.1

Not connected (* = marked no-connect by the designer): J1 A8(SBU1) B6(Dp2) B7(Dn2) B8(SBU2)

### Notes on the sheet
- (in symbol __TITLE_BLOCK__) Author:; Ben Veghte; Project:; Page Contents:; Modified Date:; Sheet; of

### Library data of the parts
J1 = USB4105-GF-A-060: USB CONN, 2.0 TYPE C, RCPT, 16POS, SMT; USB Connector Type: USB Type C; USB Standard: USB 2.0; Gender: Receptacle;...; Manufacturer: Global Connector Technology; Supplier 1: Newark; Manufacturer Part Number: USB4105-GF-A-060; RoHS: Yes; Category: Connectors; Stock 1: 1600; Pricing 1: 1=0.93700, 100=0.74000, 250=0.67600, 500=0.61600, 800=0.61600, 1000=0.57400 (USD)
R4 R5 = CMP-2000-00803-1: Manufacturer: Panasonic; Part Number: ERJ-3GEYJ512V

## Sheet Bluetooth.SchDoc
size A4; SheetNumber: 6; SheetTotal: 10
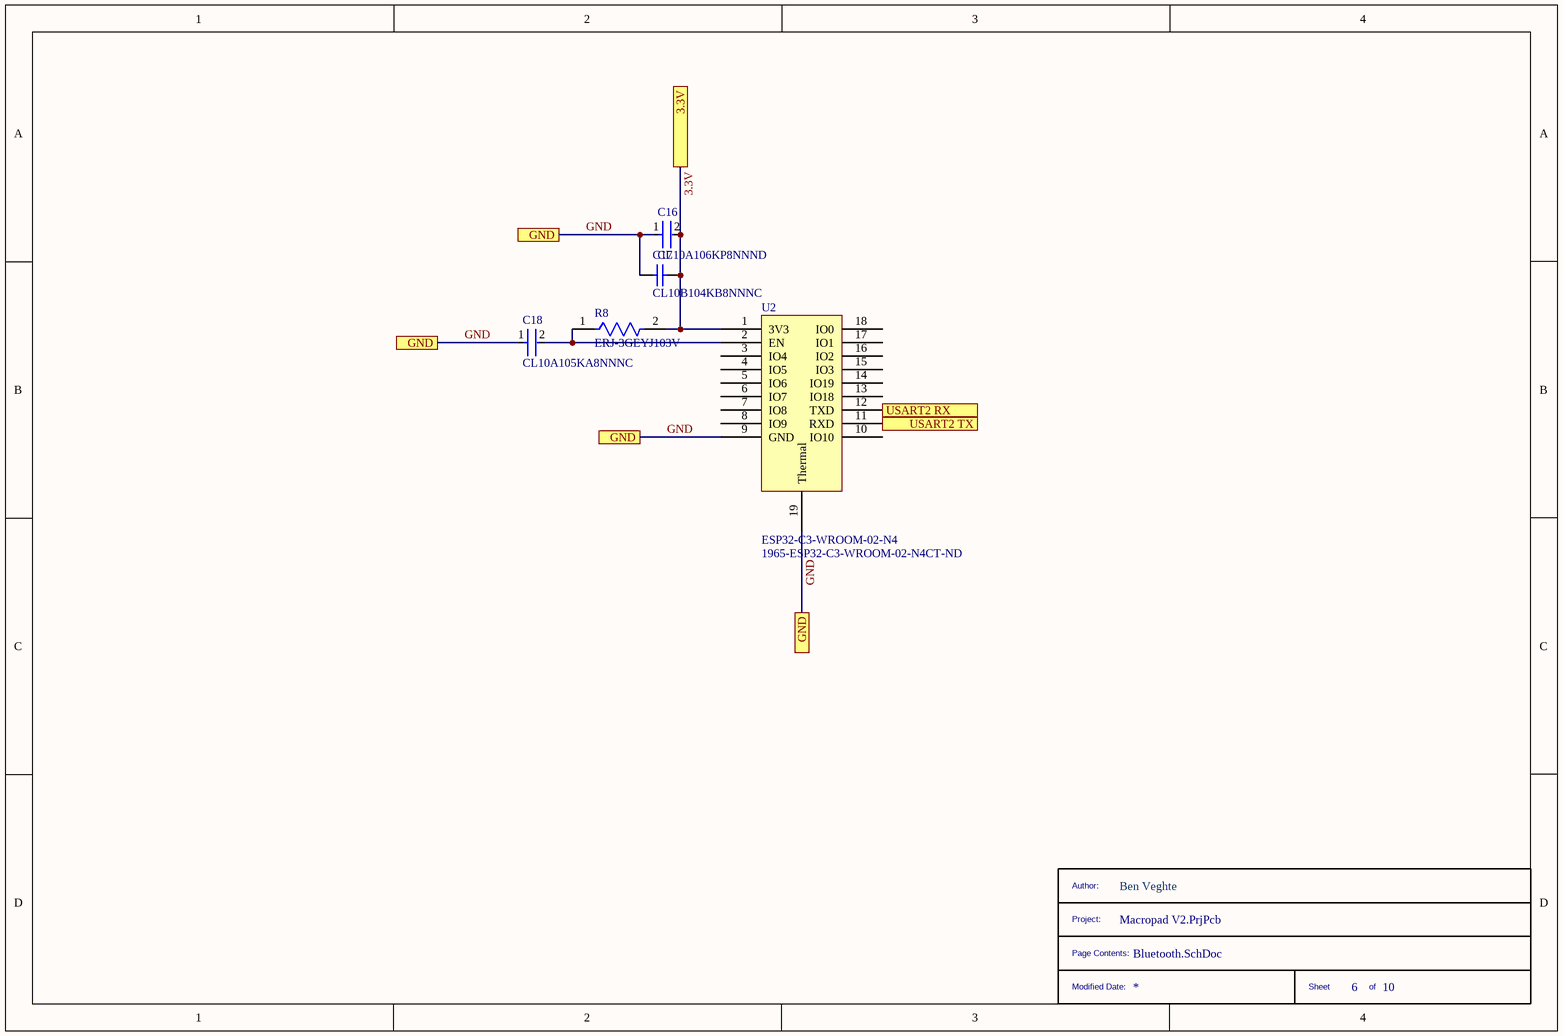
[diagram p5: Bluetooth.SchDoc]

### Parts
(Parts that share a designator on the sheet are numbered #1, #2 ... from top to bottom, then left to right.)
*#6  __TITLE_BLOCK__  (value not drawn)  (graphical)
C16  CL10A106KP8NNND  [FP-CL10-IPC_B]
C17  CL10B104KB8NNNC  [SAMS-C0603-2_M]
C18  CL10A105KA8NNNC  [FP-CL10-IPC_C]
R8  ERJ-3GEYJ103V  [FP-ERJ3G-IPC_C]
U2  ESP32-C3-WROOM-02-N4  Supplier Part Number 1: 1965-ESP32-C3-WROOM-02-N4CT-ND  [ESP32-C3-WROOM-02-N4]

### Ports
3.3V, GND, USART2 RX, USART2 TX

### Nets
3.3V: C16.2 C17.2 R8.2 U2.1(3V3) ; port 3.3V
GND: C16.1 C17.1 C18.1 U2.9(GND) U2.19(Thermal) ; port GND
NetC18_2: C18.2 R8.1 U2.2(EN)
NetU1_42: U2.11(RXD) ; port USART2 TX
NetU1_43: U2.12(TXD) ; port USART2 RX

Not connected (* = marked no-connect by the designer): U2 3(IO4) 4(IO5) 5(IO6) 6(IO7) 7(IO8) 8(IO9) 10(IO10) 13(IO18) 14(IO19) 15(IO3) 16(IO2) 17(IO1) 18(IO0)

### Notes on the sheet
- (in symbol __TITLE_BLOCK__) Author:; Ben Veghte; Project:; Page Contents:; Modified Date:; Sheet; of

### Library data of the parts
C16 = CMP-13271-003245-1: Cap Ceramic 10uF 10V X5R ±10% Pad SMD 0603 +85°C T/R; Packaging: Tape and Reel; Dielectric: X5R; Min Operating Temperature: -55°C; Lead Free: Lead Free; Height: 0.8mm; Package Quantity: 10000; Voltage Rating (DC): 10V; Mount: Surface Mount; Tolerance: 10%; Width: 0.031inch; Thickness: 0.035inch; Depth: 0.8mm; Max Operating Temperature: 85°C; Capacitance: 10uF; Case/Package: 0603; Length: 1.6mm; Voltage Rating: 10V; Radiation Hardening: No
C17 = CMP-2000-05332-1: as C1 on sheet Microcontroller; Case Size/Dimension: 0603; Datasheet URL: https://datasheet.ciiva.com/29198/456651-da-01-en-vs-kondensator-0605-29198839.pdf; Manufacturer URL: http://www.samsungsem.com/global/index.jsp; Datasheet Version: Nov-10
C18 = CMP-13271-004127-1: as C4 on sheet Microcontroller; Height: 0.8mm; Capacitance: 1uF; Depth: 0.8mm; Package Quantity: 1; Mount: Surface Mount; Contact Plating: Tin; Voltage Rating: 25V; Dielectric: X5R; Packaging: Tape and Reel; Material: Ceramic; Case Code (Metric): 1608; Length: 1.6mm; Voltage: 25V; Min Operating Temperature: -55°C; Width: 0.031inch; Tolerance: 10%; Case/Package: 0603; Radiation Hardening: No; Case Code (Imperial): 0603; Thickness: 0.035inch; Lead Free: Lead Free; Max Operating Temperature: 85°C; Voltage Rating (DC): 25V
R8 = CMP-2000-00704-2: as R9 on sheet Reset Bootloader and Mounting; Resistor Type: Thick Film; Tolerance: 5%; Military Standard: Not; Package Quantity: 1; Max Operating Temperature: 155°C; Mount: Surface Mount; Technology: THICK FILM; Case/Package: 0603; Construction: Rectangular; Depth: 0.8mm; Case Code (Imperial): 0603; Weight: 7.1E-05oz; Features: Automotive AEC-Q200; Packaging: Tape and Reel; Width: 0.8mm; Length: 1.6mm; Termination: SMD/SMT; Power Rating: 100mW; Lead Free: Lead Free; Number of Terminations: 2; Height: 0.45mm; RoHS Compliant: Yes; Min Operating Temperature: -55°C; Contact Plating: Tin; REACH SVHC: No SVHC; Resistance Tolerance: 5%; Series: ERJ; Working Voltage: 75V; Case Code (Metric): 1608
U2 = ESP32-C3-WROOM-02-N4: Manufacturer: Espressif Systems; Supplier 1: Digi-Key; Manufacturer Part Number: ESP32-C3-WROOM-02-N4; RoHS: No; Stock 1: 225; Pricing 1: 1=1.95000 (USD)

## Sheet Rotary Encoder.SchDoc
size A; SheetNumber: 6; SheetTotal: 9
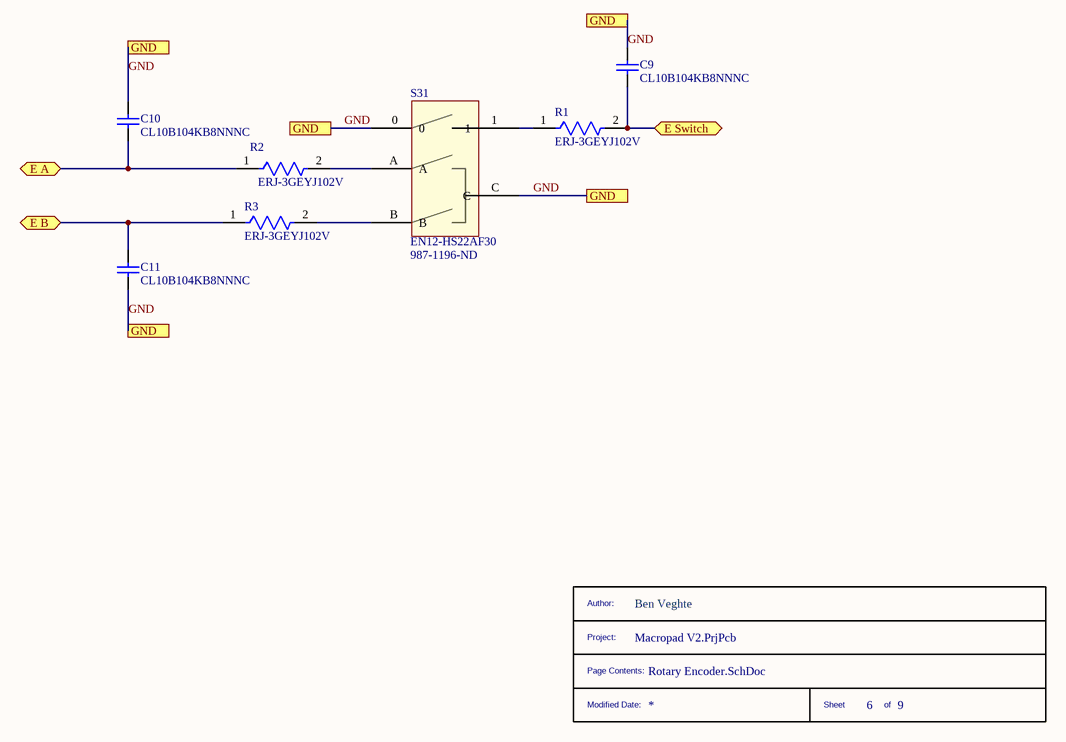
[diagram p6: Rotary Encoder.SchDoc]

### Parts
(Parts that share a designator on the sheet are numbered #1, #2 ... from top to bottom, then left to right.)
*#7  __TITLE_BLOCK__  (value not drawn)  (graphical)
C9  CL10B104KB8NNNC  [SAMS-C0603-2_M]
C10  CL10B104KB8NNNC  [SAMS-C0603-2_M]
C11  CL10B104KB8NNNC  [SAMS-C0603-2_M]
R1  ERJ-3GEYJ102V  [FP-ERJ3G-MFG]
R2  ERJ-3GEYJ102V  [FP-ERJ3G-MFG]
R3  ERJ-3GEYJ102V  [FP-ERJ3G-MFG]
S31  EN12-HS22AF30  Supplier Part Number 1: 987-1196-ND  [EN12-HS22AF30]

### Ports
E A (bidir), E B (bidir), E Switch (bidir), GND

### Nets
GND: C9.2 C10.2 C11.1 S31.0 S31.C ; port GND
NetC9_1: C9.1 R1.2 ; port E Switch
NetC10_1: C10.1 R2.1 ; port E A
NetC11_2: C11.2 R3.1 ; port E B
NetR1_1: R1.1 S31.1
NetR2_2: R2.2 S31.A
NetR3_2: R3.2 S31.B

### Notes on the sheet
- (in symbol __TITLE_BLOCK__) Author:; Ben Veghte; Project:; Page Contents:; Modified Date:; Sheet; of

### Library data of the parts
C9-C11 = CMP-2000-05332-1: as C1 on sheet Microcontroller; Case Size/Dimension: 0603; Datasheet URL: https://datasheet.ciiva.com/29198/456651-da-01-en-vs-kondensator-0605-29198839.pdf; Manufacturer URL: http://www.samsungsem.com/global/index.jsp; Datasheet Version: Nov-10
R1-R3 = CMP-2000-00703-2: RES SMD 1K OHM 5% 1/10W 0603; Manufacturer: Panasonic; Resistance: 1000Ω; Voltage: 75 V; Power Rating: 0.1W; Temperature Coefficient: 200ppm/°C; Voltage Rating: 75V; Value: 1000Ω; Automotive Grade: Grade 0; Category: Res; Ipc Land Pattern Name: RESC16080X45; Mounting Type: surface mount; Manufacturer Part Number: ERJ-3GEYJ102V; Octopart: https://octopart.com/erj-3geyj102v-panasonic-55403670; Automotive: Yes; Temperature: -55°C to +155°C; ComponentLink2Description: Datasheet; Lead Free: Yes; Footprint Url: https://industrial.panasonic.com/cdbs/www-data/pdf/RDA0000/DMA0000COL17.pdf; Tolerance: 5%; Device Class L1: Passive Components; Height: 0.55mm; Temperature Range Low: -55°C; RoHS: TRUE; Package: ERJ3G; ComponentLink2URL: https://industrial.panasonic.com/cdbs/www-data/pdf/RDA0000/AOA0000C301.pdf; Temperature Range High: +155°C; Digikey Description: RES SMD 1K OHM 5% 1/10W 0603; Series: ERJ; Device Class L2: Resistors; Device Class L3: Chip SMD Resistors; Mouser Description: Res Thick Film 0603 1K Ohm 5% 1/10W ±200ppm/°C Molded SMD Punched Carrier T/R; Composition: Thick Film
S31 = EN12-HS22AF30: Rotary Encoder; Supplier 1: Digi-Key

## Sheet OLED.SchDoc
size A; SheetNumber: 7; SheetTotal: 9
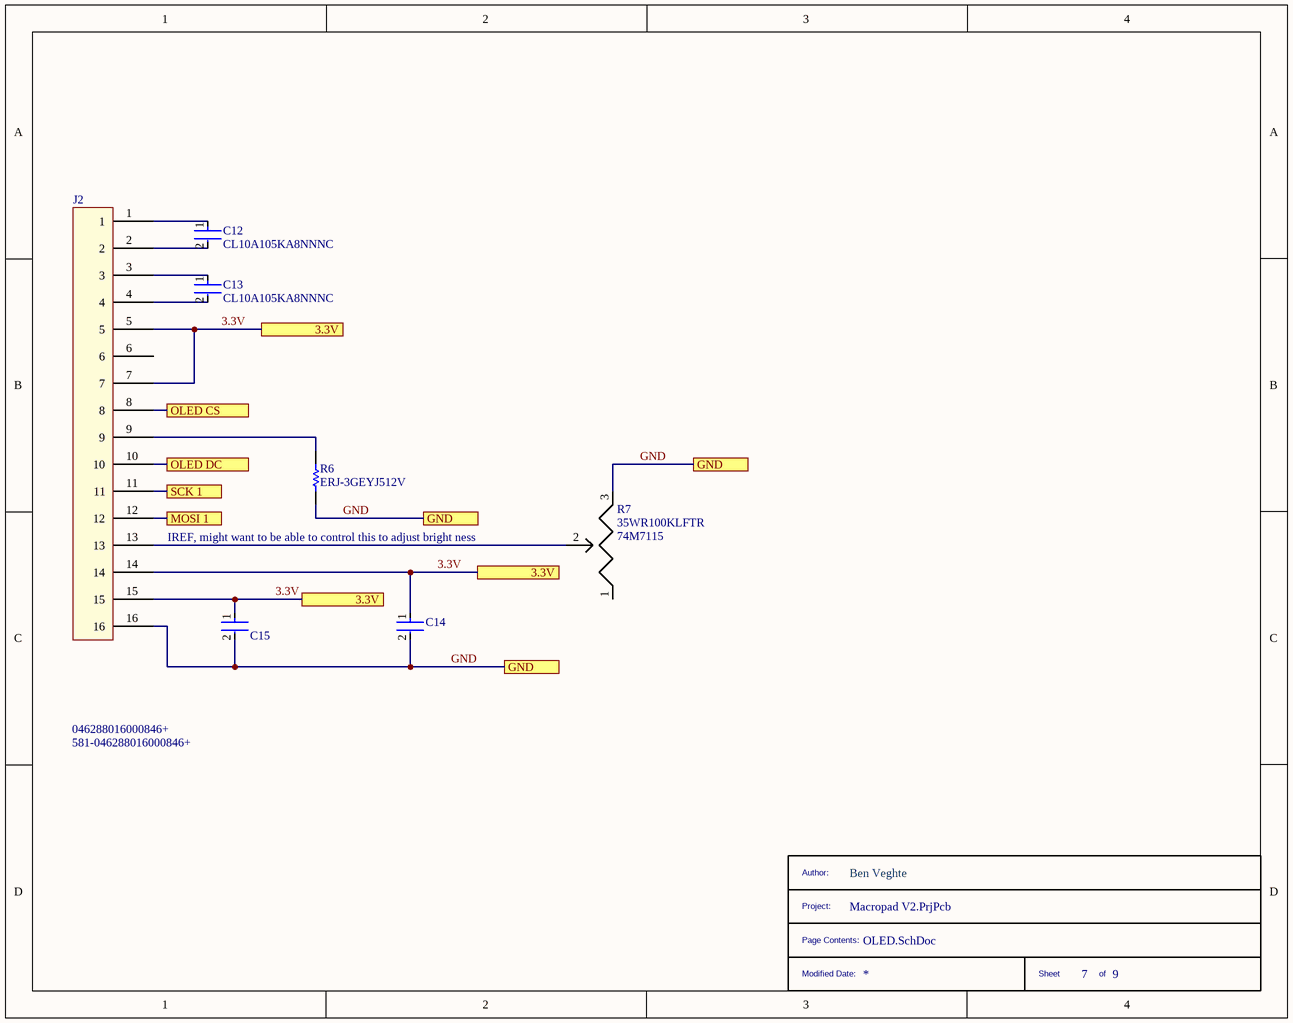
[diagram p7: OLED.SchDoc]

### Parts
(Parts that share a designator on the sheet are numbered #1, #2 ... from top to bottom, then left to right.)
*#8  __TITLE_BLOCK__  (value not drawn)  (graphical)
C12  CL10A105KA8NNNC  [FP-CL10-IPC_C]
C13  CL10A105KA8NNNC  [FP-CL10-IPC_C]
C14  CL10A106KP8NNND  [FP-CL10-IPC_B]  (value not drawn)
C15  CL10A106KP8NNND  [FP-CL10-IPC_B]  (value not drawn)
J2  046288016000846+  Supplier Part Number 1: 581-046288016000846+  [046288016000846+]
R6  ERJ-3GEYJ512V  [RESC1608X55X30LL15T15]
R7  35WR100KLFTR  Supplier Part Number 1: 74M7115  [35WR100KLFTR]

### Ports
3.3V, GND, MOSI 1, OLED CS, OLED DC, SCK 1

### Nets
3.3V: C14.1 C15.1 J2.5 J2.7 J2.14 J2.15 ; port 3.3V
GND: C14.2 C15.2 J2.16 R6.1 R7.3 ; port GND
NetC12_1: C12.1 J2.1
NetC12_2: C12.2 J2.2
NetC13_1: C13.1 J2.3
NetC13_2: C13.2 J2.4
NetJ2_8: J2.8 ; port OLED CS
NetJ2_9: J2.9 R6.2
NetJ2_10: J2.10 ; port OLED DC
NetJ2_11: J2.11 ; port SCK 1
NetJ2_12: J2.12 ; port MOSI 1
NetJ2_13: J2.13 R7.2

Not connected (* = marked no-connect by the designer): J2 6; R7 1

### Notes on the sheet
- IREF, might want to be able to control this to adjust bright ness
- (in symbol __TITLE_BLOCK__) Author:; Ben Veghte; Project:; Page Contents:; Modified Date:; Sheet; of

### Library data of the parts
C12 C13 = CMP-13271-004127-1: as C4 on sheet Microcontroller; Height: 0.8mm; Capacitance: 1uF; Depth: 0.8mm; Package Quantity: 1; Mount: Surface Mount; Contact Plating: Tin; Voltage Rating: 25V; Dielectric: X5R; Packaging: Tape and Reel; Material: Ceramic; Case Code (Metric): 1608; Length: 1.6mm; Voltage: 25V; Min Operating Temperature: -55°C; Width: 0.031inch; Tolerance: 10%; Case/Package: 0603; Radiation Hardening: No; Case Code (Imperial): 0603; Thickness: 0.035inch; Lead Free: Lead Free; Max Operating Temperature: 85°C; Voltage Rating (DC): 25V
C14 C15 = CMP-13271-003245-1: as C16 on sheet Bluetooth; Packaging: Tape and Reel; Dielectric: X5R; Min Operating Temperature: -55°C; Lead Free: Lead Free; Height: 0.8mm; Package Quantity: 10000; Voltage Rating (DC): 10V; Mount: Surface Mount; Tolerance: 10%; Width: 0.031inch; Thickness: 0.035inch; Depth: 0.8mm; Max Operating Temperature: 85°C; Capacitance: 10uF; Case/Package: 0603; Length: 1.6mm; Voltage Rating: 10V; Radiation Hardening: No
J2 = 046288016000846+: Conn FFC/FPC Connector SKT 16 POS 0.5mm Solder RA SMD Automotive T/R; Manufacturer: Kyocera AVX; Current Rating: 400mA; Voltage Rating: 50V; Number of Positions: 16; Contact Location: Bottom; Gender: Male; Supplier 1: Mouser; Manufacturer Part Number: 046288016000846+; RoHS: Yes; Category: FFC / FPC; Stock 1: 2627; Pricing 1: 1=1.38000, 10=1.22000, 50=1.22000, 100=1.05000, 200=0.95100, 500=0.85600, 1000=0.76100, 2000=0.62700, 4000=0.61800, 10000=0.61800 (USD); Mount: Surface Mount; Contact Material: Copper Alloy; Contact Plating: Gold; Housing Material: Plastic; Min Operating Temperature: -40°C; Max Operating Temperature: 105°C; Packaging: Tape and Reel; Number of Rows: 1; Termination: Solder; Orientation: Right Angle; Package Quantity: 1; Number of Contacts: 16; Series: 6288; Pitch: 0.5mm; Radiation Hardening: No; Lead Free: Lead Free; ComponentLink1URL: https://datasheet.ciiva.com/10366/6288-10366323.pdf?src-supplier=Avnet; ComponentLink1Description: https://datasheet.ciiva.com/10366/6288-10366323.pdf?src-supplier=Avnet; ComponentLink2URL: https://datasheet.ciiva.com/18454/70107521-18454565.pdf?src-supplier=Allied+Electronics; ComponentLink2Description: https://datasheet.ciiva.com/18454/70107521-18454565.pdf?src-supplier=Allied+Electronics; ComponentLink3URL: https://datasheet.ciiva.com/671/6288-671255.pdf?src-supplier=Digi-Key; ComponentLink3Description: https://datasheet.ciiva.com/671/6288-671255.pdf?src-supplier=Digi-Key; ComponentLink4URL: https://datasheet.ciiva.com/16327/6288-16327495.pdf?src-supplier=Future+Electronics; ComponentLink4Description: https://datasheet.ciiva.com/16327/6288-16327495.pdf?src-supplier=Future+Electronics; ComponentLink5URL: https://datasheet.ciiva.com/671/6288-671256.pdf?src-supplier=Digi-Key; ComponentLink5Description: https://datasheet.ciiva.com/671/6288-671256.pdf?src-supplier=Digi-Key; ComponentLink6URL: https://datasheet.ciiva.com/671/6288-671257.pdf?src-supplier=Digi-Key; ComponentLink6Description: https://datasheet.ciiva.com/671/6288-671257.pdf?src-supplier=Digi-Key
R6 = CMP-2000-00803-1: Manufacturer: Panasonic; Part Number: ERJ-3GEYJ512V
R7 = 35WR100KLFTR: 35W Series 3 mm Open Frame 100 kOhm ±25 % Single-Turn Trimming Potentiometer; Manufacturer: TT BI; Resistance: 100kR; Power Rating: 100mW; Tolerance: 25%; Voltage Rating: 50V; Number of Turns: 1; Insulation Resistance: 100MR; Temperature Coefficient: 250ppm/°C; Supplier 1: Newark; Manufacturer Part Number: 35WR100KLFTR; RoHS: Yes; Category: Variable Resistors and Potentiometers; Stock 1: 19940; Pricing 1: 1=0.35800, 10=0.34100, 25=0.32400, 50=0.30100, 100=0.28500, 250=0.27700, 500=0.24900, 1000=0.23800 (USD); Min Operating Temperature: -40°C; Max Operating Temperature: 125°C; Package Quantity: 2000; Packaging: Tape and Reel; Resistor Type: Cermet; Termination: Solder; Voltage Rating (DC): 50V; Type: Potentiometer; Resistance Tolerance: 25%; Series: 37; Width: 1.55mm; REACH SVHC: No SVHC; Lead Free: Lead Free; RoHS Compliant: Yes; ComponentLink1URL: https://datasheet.ciiva.com/22715/4701-22715101.pdf?src-supplier=Element14; ComponentLink1Description: https://datasheet.ciiva.com/22715/4701-22715101.pdf?src-supplier=Element14; ComponentLink2URL: https://datasheet.ciiva.com/7634/4701-7634922.pdf?src-supplier=Element14; ComponentLink2Description: https://datasheet.ciiva.com/7634/4701-7634922.pdf?src-supplier=Element14

## Sheet Flash Memory.SchDoc
size A; SheetNumber: 9; SheetTotal: 9
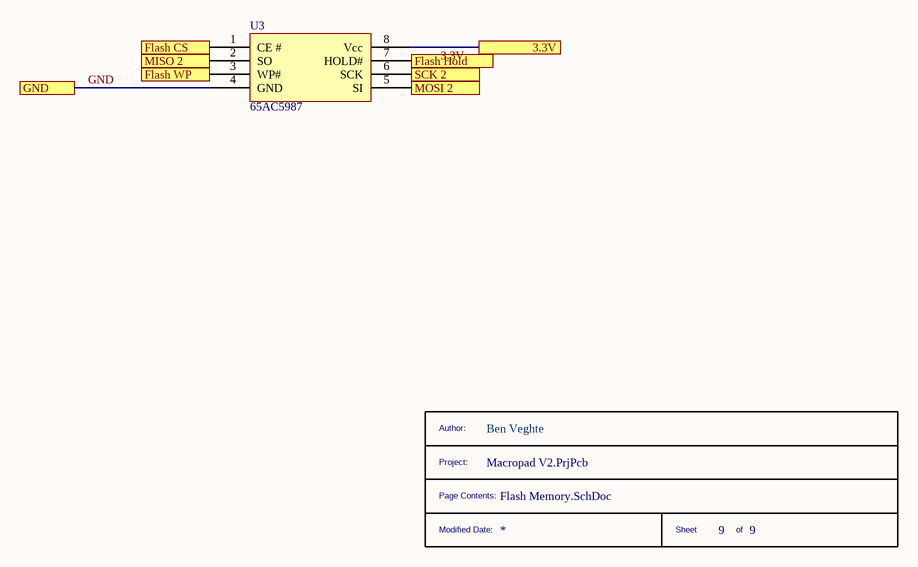
[diagram p8: Flash Memory.SchDoc]

### Parts
(Parts that share a designator on the sheet are numbered #1, #2 ... from top to bottom, then left to right.)
*#9  __TITLE_BLOCK__  (value not drawn)  (graphical)
U3  Supplier Part Number 1: 65AC5987  [IS25LQ020B-JNLE]  (hidden comment: IS25LQ020B-JNLE)

### Ports
3.3V, Flash CS, Flash Hold, Flash WP, GND, MISO 2, MOSI 2, SCK 2

### Nets
3.3V: U3.8(Vcc) ; port 3.3V
GND: U3.4(GND) ; port GND
NetU1_6: U3.7(HOLD#) ; port Flash Hold
NetU1_8: U3.3(WP#) ; port Flash WP
NetU1_9: U3.1(CE_#) ; port Flash CS
NetU1_10: U3.2(SO) ; port MISO 2
NetU1_11: U3.5(SI) ; port MOSI 2
NetU1_29: U3.6(SCK) ; port SCK 2

### Notes on the sheet
- (in symbol __TITLE_BLOCK__) Author:; Ben Veghte; Project:; Page Contents:; Modified Date:; Sheet; of

### Library data of the parts
U3 = IS25LQ020B-JNLE: NOR Flash Serial (SPI, Dual SPI, Quad SPI) 2.5V/3V/3.3V 2M-bit 256K x 8 8ns 8-Pin SOIC N; Manufacturer: ISSI; Memory Type: FLASH,NOR; Frequency: 104MHz; Interface: SPI,Serial; Density: 2Mb; Operating Supply Voltage: 3.3V; Address Bus Width: 24b; Page Size: 256B; Min Supply Voltage: 2.3V; Max Supply Voltage: 3.6V; Supplier 1: Newark; Manufacturer Part Number: IS25LQ020B-JNLE; RoHS: Yes; Category: Memory; Stock 1: 799; Pricing 1: 1=0.45200, 10=0.41800, 100=0.37600, 500=0.35200 (USD); Mount: Surface Mount; Case/Package: SOIC; Number of Pins: 8; Min Operating Temperature: -40°C; Max Operating Temperature: 105°C; Packaging: Bulk; Access Time: 8ns; RoHS Compliant: Yes; ComponentLink1URL: http://www.mouser.com/ds/2/198/25LQ025B-512B-010B-020B-040B-706473.pdf?src-supplier=Mouser; ComponentLink1Description: http://www.mouser.com/ds/2/198/25LQ025B-512B-010B-020B-040B-706473.pdf?src-supplier=Mouser; ComponentLink2URL: http://www.issi.com/WW/pdf/25LQ025B-512B-010B-020B-040B.pdf?src-supplier=Avnet; ComponentLink2Description: http://www.issi.com/WW/pdf/25LQ025B-512B-010B-020B-040B.pdf?src-supplier=Avnet; ComponentLink3URL: http://www.issi.com/WW/pdf/25LQ025B-512B-010B-020B-040B.pdf?src-supplier=Digi-Key; ComponentLink3Description: http://www.issi.com/WW/pdf/25LQ025B-512B-010B-020B-040B.pdf?src-supplier=Digi-Key; ComponentLink4URL: http://www.farnell.com/datasheets/2625712.pdf?src-supplier=Newark; ComponentLink4Description: http://www.farnell.com/datasheets/2625712.pdf?src-supplier=Newark

## Nets that join several sheets
3.3V: Microcontroller (11 pins), Battery Load Share V2 (C22.1 U5.1), Reset Bootloader and Mounting (J3.1 S33.1), Bluetooth (C16.2 C17.2 R8.2 U2.1), OLED (6 pins), Flash Memory (U3.8)
GND: Microcontroller (11 pins), Battery Load Share V2 (10 pins), Reset Bootloader and Mounting (13 pins), USB C Port (8 pins), Bluetooth (5 pins), Rotary Encoder (5 pins), OLED (5 pins), Flash Memory (U3.4)
NetC9_1: Microcontroller (U1.16), Rotary Encoder (C9.1 R1.2)
NetC10_1: Microcontroller (U1.14), Rotary Encoder (C10.1 R2.1)
NetC11_2: Microcontroller (U1.15), Rotary Encoder (C11.2 R3.1)
NetC19_1: Microcontroller (U1.7), Reset Bootloader and Mounting (C19.1 J3.10 S32.1 S32.3)
NetD1_1: Microcontroller (U1.25), Keyboard Matrix (6 pins)
NetD2_1: Microcontroller (U1.26), Keyboard Matrix (6 pins)
NetD3_1: Microcontroller (U1.27), Keyboard Matrix (6 pins)
NetD4_1: Microcontroller (U1.28), Keyboard Matrix (6 pins)
NetD5_1: Microcontroller (U1.30), Keyboard Matrix (6 pins)
NetJ2_8: Microcontroller (U1.24), OLED (J2.8)
NetJ2_10: Microcontroller (U1.22), OLED (J2.10)
NetJ2_11: Microcontroller (U1.21), OLED (J2.11)
NetJ2_12: Microcontroller (U1.23), OLED (J2.12)
NetJ3_2: Microcontroller (U1.46), Reset Bootloader and Mounting (J3.2)
NetJ3_4: Microcontroller (U1.49), Reset Bootloader and Mounting (J3.4)
NetR9_1: Microcontroller (U1.60), Reset Bootloader and Mounting (R9.1)
NetS1_0: Microcontroller (U1.38), Keyboard Matrix (5 pins)
NetS6_0: Microcontroller (U1.37), Keyboard Matrix (5 pins)
NetS11_0: Microcontroller (U1.36), Keyboard Matrix (5 pins)
NetS16_0: Microcontroller (U1.35), Keyboard Matrix (5 pins)
NetS21_0: Microcontroller (U1.34), Keyboard Matrix (5 pins)
NetS26_0: Microcontroller (U1.33), Keyboard Matrix (5 pins)
NetU1_6: Microcontroller (U1.6), Flash Memory (U3.7)
NetU1_8: Microcontroller (U1.8), Flash Memory (U3.3)
NetU1_9: Microcontroller (U1.9), Flash Memory (U3.1)
NetU1_10: Microcontroller (U1.10), Flash Memory (U3.2)
NetU1_11: Microcontroller (U1.11), Flash Memory (U3.5)
NetU1_29: Microcontroller (U1.29), Flash Memory (U3.6)
NetU1_42: Microcontroller (U1.42), Bluetooth (U2.11)
NetU1_43: Microcontroller (U1.43), Bluetooth (U2.12)
USB_N: Microcontroller (U1.44), USB C Port (J1.A7)
USB_P: Microcontroller (U1.45), USB C Port (J1.A6)
VUSB: Battery Load Share V2 (5 pins), USB C Port (J1.A4/B9 J1.B4/A9)